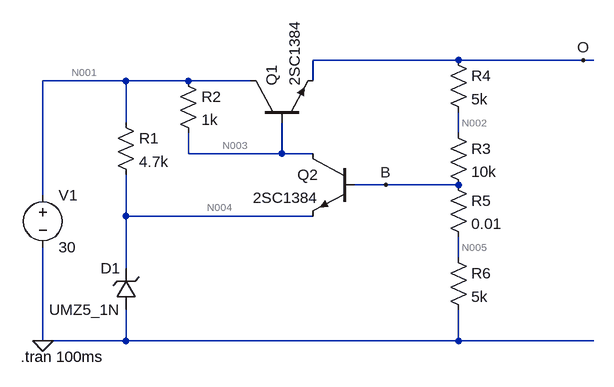
[diagram p0: schematic Draft3.asc]
Draft3.asc, the LTspice schematic file:
Version 4
SHEET 1 984 680
WIRE 704 -160 480 -160
WIRE 896 -160 704 -160
WIRE 912 -160 896 -160
WIRE 192 -128 64 -128
WIRE 288 -128 192 -128
WIRE 384 -128 288 -128
WIRE 480 -128 480 -160
WIRE 192 -64 192 -128
WIRE 704 -48 704 -80
WIRE 288 -16 288 -48
WIRE 432 -16 432 -64
WIRE 432 -16 288 -16
WIRE 480 -16 432 -16
WIRE 592 32 544 32
WIRE 704 32 592 32
WIRE 64 48 64 -128
WIRE 192 80 192 16
WIRE 480 80 192 80
WIRE 704 144 704 112
WIRE 192 160 192 80
WIRE 64 272 64 128
WIRE 192 272 192 224
WIRE 192 272 64 272
WIRE 704 272 704 224
WIRE 704 272 192 272
WIRE 912 272 704 272
FLAG 592 32 B
FLAG 896 -160 O
FLAG 64 272 0
SYMBOL voltage 64 32 R0
WINDOW 123 0 0 Left 0
WINDOW 39 0 0 Left 0
SYMATTR InstName V1
SYMATTR Value 30
SYMBOL res 176 -80 R0
SYMATTR InstName R1
SYMATTR Value 4.7k
SYMBOL res 272 -144 R0
SYMATTR InstName R2
SYMATTR Value 1k
SYMBOL npn 384 -64 R270
SYMATTR InstName Q1
SYMATTR Value 2SC1384
SYMBOL npn 544 -16 M0
SYMATTR InstName Q2
SYMATTR Value 2SC1384
SYMBOL zener 208 224 R180
WINDOW 0 24 64 Left 2
WINDOW 3 24 0 Left 2
SYMATTR InstName D1
SYMATTR Value UMZ5_1N
SYMBOL res 688 -64 R0
SYMATTR InstName R3
SYMATTR Value 10k
SYMBOL res 688 -176 R0
SYMATTR InstName R4
SYMATTR Value 5k
SYMBOL res 688 16 R0
SYMATTR InstName R5
SYMATTR Value 0.01
SYMBOL res 688 128 R0
SYMATTR InstName R6
SYMATTR Value 5k
TEXT 30 296 Left 2 !.tran 100ms

The netlist it stands for:
* Draft3.asc
V1 N001 0 30
R1 N001 N004 4.7k
R2 N001 N003 1k
Q1 N001 N003 O 0 2SC1384
Q2 N003 B N004 0 2SC1384
D1 0 N004 UMZ5_1N
R3 N002 B 10k
R4 O N002 5k
R5 B N005 0.01
R6 N005 0 5k
.model D D
.lib standard.dio
.model NPN NPN
.model PNP PNP
.lib standard.bjt
.tran 100ms
.backanno
.end

* Results of the author's LTspice run, read from the files saved beside the schematic
* Operating Point, zero values left out:
*   V(n001) = 30 V
*   V(n004) = 5.099 V
*   V(n003) = 24.21 V
*   V(o) = 23.59 V
*   V(b) = 5.754 V
*   V(n002) = 17.64 V
*   V(n005) = 5.754 V
*   Ic(Q1) = 1.178 mA
*   Ib(Q1) = 11.26 µA
*   Ie(Q1) = -1.189 mA
*   Ic(Q2) = 5.781 mA
*   Ib(Q2) = 38.16 µA
*   Ie(Q2) = -5.819 mA
*   I(D1) = -11.12 mA
*   I(R1) = 5.298 mA
*   I(R2) = 5.792 mA
*   I(R3) = 1.189 mA
*   I(R4) = 1.189 mA
*   I(R5) = 1.151 mA
*   I(R6) = 1.151 mA
*   I(V1) = -12.27 mA